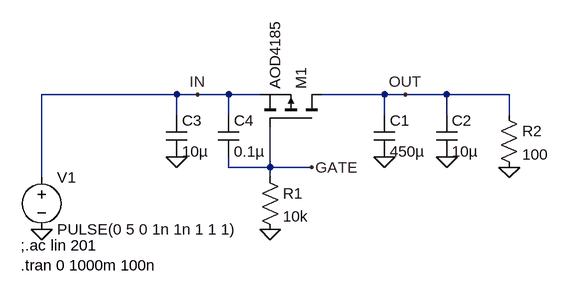
[diagram p0: schematic DC_Metro_Inrush_Circuit_2025-01-09.asc]
DC_Metro_Inrush_Circuit_2025-01-09.asc, the LTspice schematic file:
Version 4
SHEET 1 880 680
WIRE -32 32 -240 32
WIRE 0 32 -32 32
WIRE 48 32 0 32
WIRE 96 32 48 32
WIRE 288 32 192 32
WIRE 320 32 288 32
WIRE 384 32 320 32
WIRE 480 32 384 32
WIRE -32 64 -32 32
WIRE 48 64 48 32
WIRE 288 64 288 32
WIRE 384 64 384 32
WIRE 480 64 480 32
WIRE 48 144 48 128
WIRE 112 144 112 80
WIRE 112 144 48 144
WIRE 176 144 112 144
WIRE -240 160 -240 32
WIRE 112 160 112 144
FLAG -240 240 0
FLAG -32 128 0
FLAG 112 240 0
FLAG 288 128 0
FLAG 384 128 0
FLAG 480 144 0
FLAG 320 32 OUT
FLAG 0 32 IN
FLAG 176 144 GATE
SYMBOL pmos 192 80 M270
SYMATTR InstName M1
SYMATTR Value AOD4185
SYMBOL cap 272 64 R0
SYMATTR InstName C1
SYMATTR Value 450µ
SYMBOL cap 368 64 R0
SYMATTR InstName C2
SYMATTR Value 10µ
SYMBOL cap -48 64 R0
SYMATTR InstName C3
SYMATTR Value 10µ
SYMBOL cap 32 64 R0
SYMATTR InstName C4
SYMATTR Value 0.1µ
SYMBOL res 96 144 R0
SYMATTR InstName R1
SYMATTR Value 10k
SYMBOL voltage -240 144 R0
WINDOW 123 0 0 Left 0
WINDOW 39 0 0 Left 0
SYMATTR InstName V1
SYMATTR Value PULSE(0 5 0 1n 1n 1 1 1)
SYMBOL res 464 48 R0
SYMATTR InstName R2
SYMATTR Value 100
TEXT -272 264 Left 2 !;.ac lin 201\n.tran 0 1000m 100n

The netlist it stands for:
* DC_Metro_Inrush_Circuit_2025-01-09.asc
M1 OUT GATE IN IN AOD4185
C1 OUT 0 450µ
C2 OUT 0 10µ
C3 IN 0 10µ
C4 IN GATE 0.1µ
R1 GATE 0 10k
V1 IN 0 PULSE(0 5 0 1n 1n 1 1 1)
R2 OUT 0 100
.model NMOS NMOS
.model PMOS PMOS
.lib standard.mos
;.ac lin 201
.tran 0 1000m 100n
.backanno
.end